# EAGLE schematic Amp+Speaker (EAGLE 7.3.0)
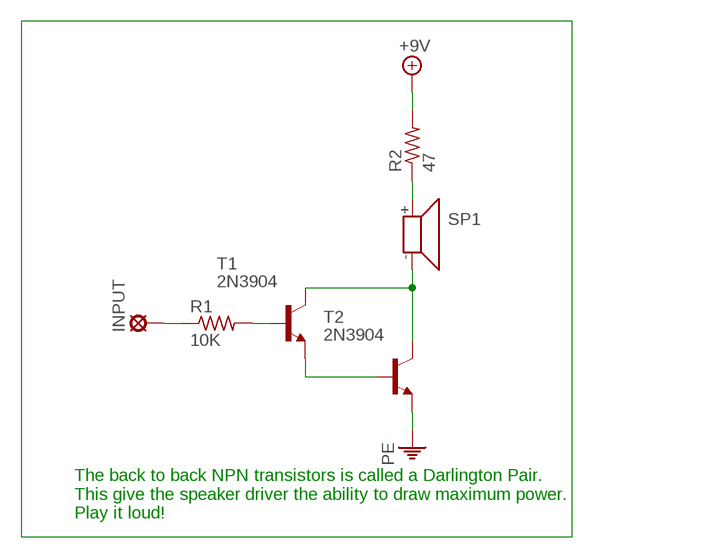
[diagram p0: schematic, sheet 1]

## Parts
INPUT  MCS10B  [MCS10B]
R1  10K  R-US_0204/7  [0204/7]
R2  47  R-US_0204/7  [0204/7]
SP1  SMS-1308MS-2-R  [SMS-1308MS-2-R]
T1  2N3904  [TO92]
T2  2N3904  [TO92]

## Nets
+9V: R2.2
N$1: INPUT.MP R1.1
N$2: R1.2 T1.2(B)
N$3: SP1.- T1.1(C) T2.1(C)
N$4: T1.3(E) T2.2(B)
N$5: R2.1 SP1.+
PE: T2.3(E)

## Notes on the sheet
- The back to back NPN transistors is called a Darlington Pair.
  This give the speaker driver the ability to draw maximum power.
  Play it loud!

## Library data of the parts
INPUT = solpad:MCS10B: SOLDER PAD MC S1, distributor Buerklin, 15F505
R1 R2 = rcl:R-US_: RESISTOR, American symbol
SP1 = speaker:SMS-1308MS-2-R: Speaker 13 x 13mm, 8 Ohm, 0.7W Source: pui audio inc. SMS-1308MS-2-R.pdf
T1 T2 = transistor:2N3904: NPN TRANSISTOR